# Altium schematic sheet MainBoard.SchDoc
size A4
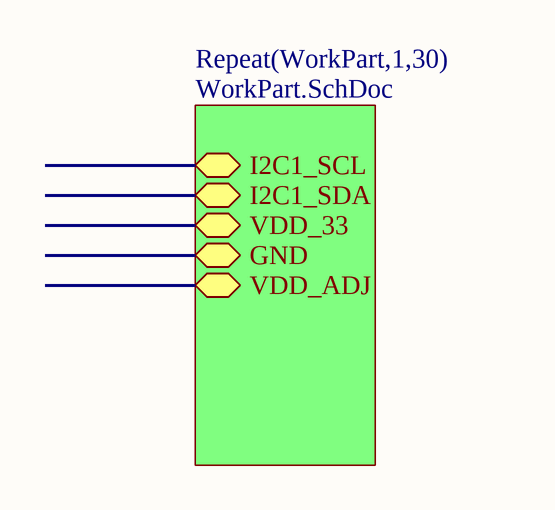
[diagram p0: MainBoard.SchDoc]

## Sub-sheets
Repeat(WorkPart,1,30) = WorkPart.SchDoc: I2C1_SCL, I2C1_SDA, VDD_33, GND, VDD_ADJ